# Altium schematic sheet MCU.SchDoc
size A4
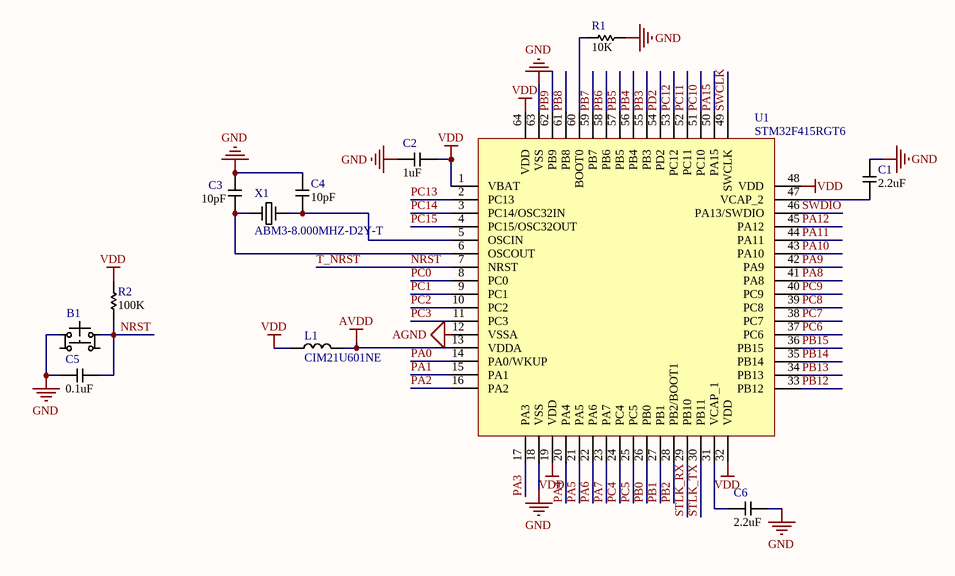
[diagram p0: MCU.SchDoc]

## Parts
B1  DTSM-65R-V-T/R  [Diptronics_DTSM-65_Red_4]  (value not drawn)
C1  value 2.2uF  [Kemet_0805_X7R]  (hidden comment: C0805C104K3RACTU)
C2  value 1uF  [Kemet_0805_X7R]  (hidden comment: C0805C105K4RACTU)
C3  value 10pF  [Kemet_0805_X7R]  (hidden comment: C0805C104K3RACTU)
C4  value 10pF  [Kemet_0805_X7R]  (hidden comment: C0805C104K3RACTU)
C5  value 0.1uF  [Kemet_0805_X7R]  (hidden comment: C0805C104K3RACTU)
C6  value 2.2uF  [Kemet_0805_X7R]  (hidden comment: C0805C104K3RACTU)
L1  CIM21U601NE  [SAMSUNG_INDC200X125X110L45N]
R1  value 10K  [VISHAY_RESC205X125X50L35_30N]  (hidden comment: CRCW08050000Z0EA)
R2  value 100K  [VISHAY_RESC205X125X50L35_30N]  (hidden comment: CRCW08050000Z0EA)
U1  STM32F415RGT6  [STM_QFP64P50_1200X1200X160L60X22N]
X1  ABM3-8.000MHZ-D2Y-T  [ABRACON_XTALDFN2_500X320X130L130X200N]

## Nets
AGND: U1.12(VSSA)
AVDD: L1.2 U1.13(VDDA)
GND: B1.1 C1.1 C2.1 C3.2 C4.2 C5.1 C6.1 R1.1 U1.18(VSS) U1.63(VSS)
VDD: C2.2 L1.1 R2.1 U1.1(VBAT) U1.19(VDD) U1.32(VDD) U1.48(VDD) U1.64(VDD)
NRST: B1.3 C5.2 R2.2 U1.7(NRST)  [also labelled T_NRST]
PA0: U1.14(PA0/WKUP)
PA1: U1.15(PA1)
PA2: U1.16(PA2)
PA3: U1.17(PA3)
PA4: U1.20(PA4)
PA5: U1.21(PA5)
PA6: U1.22(PA6)
PA7: U1.23(PA7)
PA8: U1.41(PA8)
PA9: U1.42(PA9)
PA10: U1.43(PA10)
PA11: U1.44(PA11)
PA12: U1.45(PA12)
PA15: U1.50(PA15)
PB0: U1.26(PB0)
PB1: U1.27(PB1)
PB2: U1.28(PB2/BOOT1)
PB3: U1.55(PB3)
PB4: U1.56(PB4)
PB5: U1.57(PB5)
PB6: U1.58(PB6)
PB7: U1.59(PB7)
PB8: U1.61(PB8)
PB9: U1.62(PB9)
PB12: U1.33(PB12)
PB13: U1.34(PB13)
PB14: U1.35(PB14)
PB15: U1.36(PB15)
PC0: U1.8(PC0)
PC1: U1.9(PC1)
PC2: U1.10(PC2)
PC3: U1.11(PC3)
PC4: U1.24(PC4)
PC5: U1.25(PC5)
PC6: U1.37(PC6)
PC7: U1.38(PC7)
PC8: U1.39(PC8)
PC9: U1.40(PC9)
PC10: U1.51(PC10)
PC11: U1.52(PC11)
PC12: U1.53(PC12)
PC13: U1.2(PC13)
PC14: U1.3(PC14/OSC32IN)
PC15: U1.4(PC15/OSC32OUT)
PD2: U1.54(PD2)
STLK_RX: U1.29(PB10)
STLK_TX: U1.30(PB11)
SWCLK: U1.49(SWCLK)
SWDIO: U1.46(PA13/SWDIO)
NetC1_2: C1.2 U1.47(VCAP_2)
NetC3_1: C3.1 U1.6(OSCOUT) X1.1
NetC4_1: C4.1 U1.5(OSCIN) X1.2
NetC6_2: C6.2 U1.31(VCAP_1)
NetR1_2: R1.2 U1.60(BOOT0)

Not connected (* = marked no-connect by the designer): B1 2 4

## Library data of the parts
B1 = DTSM-65R-V-T/R: Button_SMD_4_6x6x9.5_Diptronics; Dimensions: 6x6x9.5; Mounting Type: SMT; Manufacturer: Diptronics; Purchase Link: https://www.ozdisan.com/elektromekanik-komponentler/sivicler-anahtarlar/tact-sivicler/DTSM-65R-V-TR; Package: DTSM-65; Number of Pins: 4; Color: Red
C1 C3-C6 = C0805C104K3RACTU: Cap_0805_0.1uF_25VDC_Kemet; Manufacturer: Kemet; Voltage: 25VDC; Tolerance: 10%; Dimensions: 2x1.25x0.9; Mounting Type: SMT; Package: 0805; Purchase Link: https://www.ozdisan.com/pasif-komponentler/kondansatorler/smd-kondansatorler-mlcc/C0805C105K4RACTU
C2 = C0805C105K4RACTU: Cap_0805_1uF_16VDC_Kemet; Manufacturer: Kemet; Voltage: 16VDC; Tolerance: 2%; Dimensions: 2x1.25x0.9; Mounting Type: SMT; Package: 0805; Purchase Link: https://www.ozdisan.com/pasif-komponentler/kondansatorler/smd-kondansatorler-mlcc/C0805C105K4RACTU
L1 = CIM21U601NE: Bead_600R_500mA_0805_Samsung; Manufacturer: Samsung; Mounting Type: SMT; Package: 0805; Purchase Link: https://ozdisan.com/Product/Detail/406952/CIM21U601NE
R1 R2 = CRCW08050000Z0EA: Res_0805_0R_1/8W_Vishay; Manufacturer: Vishay; Power: 1/8W; Tolerance: Jumper; Dimensions: 2x1.25x0.45; Mounting Type: SMT; Package: 0805; Purchase Link: https://www.ozdisan.com/pasif-komponentler/direncler/smt-smd-direncler/CRCW08050000Z0EA
U1 = STM32F415RGT6: Microcontroller_STM; Manufacturer: STM; Package: LQFP64; Mounting Type: SMT; Purchase Link: https://ozdisan.com/Product/Detail/483733/STM32F415RGT6
X1 = ABM3-8.000MHZ-D2Y-T: Crystal_8MHz_18pF_140R_20PPM_30PPM_Abracon; Load Capacitance: 18pF; ESR: 140R; Frequency Stability: 30PPM; Frequency Tolerance: 20PPM; Frequency: 8MHz; Manufacturer: Abracon; Dimensions: 5x3.2x1.3; Package: ABM3; Mounting Type: SMT; Purchase Link: https://www.ozdisan.com/pasif-komponentler/kristaller-osilatorler-rezanatorler/kristal/ABM3-8-000MHZ-D2Y-T